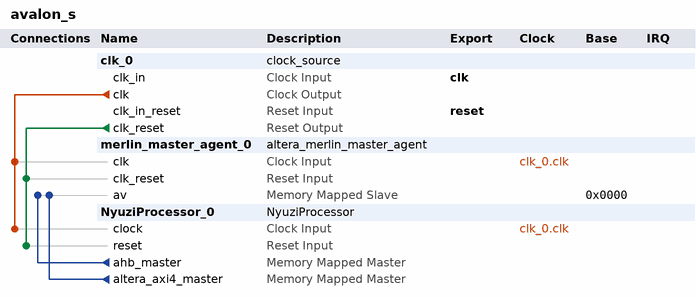
[diagram p0: system contents]
# Platform Designer (Qsys) system avalon_s, Cyclone V 5CSXFC6D6F31C8ES
# Parameters at their usual value, and those the tool derives, are not listed.
package require -exact qsys 13.0
create_system avalon_s
set_project_property DEVICE_FAMILY {Cyclone V}
set_project_property DEVICE 5CSXFC6D6F31C8ES

add_instance clk_0 clock_source 13.0
set_instance_parameter_value clk_0 clockFrequency 50000000

add_instance merlin_master_agent_0 altera_merlin_master_agent 13.0
set_instance_parameter_value merlin_master_agent_0 PKT_PROTECTION_H 80
set_instance_parameter_value merlin_master_agent_0 PKT_PROTECTION_L 80
set_instance_parameter_value merlin_master_agent_0 PKT_BEGIN_BURST 81
set_instance_parameter_value merlin_master_agent_0 PKT_BURSTWRAP_H 79
set_instance_parameter_value merlin_master_agent_0 PKT_BURSTWRAP_L 77
set_instance_parameter_value merlin_master_agent_0 PKT_BURST_SIZE_H 86
set_instance_parameter_value merlin_master_agent_0 PKT_BURST_SIZE_L 84
set_instance_parameter_value merlin_master_agent_0 PKT_BURST_TYPE_H 94
set_instance_parameter_value merlin_master_agent_0 PKT_BURST_TYPE_L 93
set_instance_parameter_value merlin_master_agent_0 PKT_BYTE_CNT_H 76
set_instance_parameter_value merlin_master_agent_0 PKT_BYTE_CNT_L 74
set_instance_parameter_value merlin_master_agent_0 PKT_ADDR_H 73
set_instance_parameter_value merlin_master_agent_0 PKT_ADDR_L 42
set_instance_parameter_value merlin_master_agent_0 PKT_TRANS_COMPRESSED_READ 41
set_instance_parameter_value merlin_master_agent_0 PKT_TRANS_POSTED 40
set_instance_parameter_value merlin_master_agent_0 PKT_TRANS_WRITE 39
set_instance_parameter_value merlin_master_agent_0 PKT_TRANS_READ 38
set_instance_parameter_value merlin_master_agent_0 PKT_TRANS_LOCK 82
set_instance_parameter_value merlin_master_agent_0 PKT_TRANS_EXCLUSIVE 83
set_instance_parameter_value merlin_master_agent_0 PKT_DATA_H 37
set_instance_parameter_value merlin_master_agent_0 PKT_DATA_L 6
set_instance_parameter_value merlin_master_agent_0 PKT_BYTEEN_H 5
set_instance_parameter_value merlin_master_agent_0 PKT_BYTEEN_L 2
set_instance_parameter_value merlin_master_agent_0 PKT_SRC_ID_H 1
set_instance_parameter_value merlin_master_agent_0 PKT_SRC_ID_L 1
set_instance_parameter_value merlin_master_agent_0 PKT_DEST_ID_H 0
set_instance_parameter_value merlin_master_agent_0 PKT_DEST_ID_L 0
set_instance_parameter_value merlin_master_agent_0 PKT_THREAD_ID_H 88
set_instance_parameter_value merlin_master_agent_0 PKT_THREAD_ID_L 87
set_instance_parameter_value merlin_master_agent_0 PKT_CACHE_H 92
set_instance_parameter_value merlin_master_agent_0 PKT_CACHE_L 89
set_instance_parameter_value merlin_master_agent_0 PKT_DATA_SIDEBAND_H 105
set_instance_parameter_value merlin_master_agent_0 PKT_DATA_SIDEBAND_L 98
set_instance_parameter_value merlin_master_agent_0 PKT_QOS_H 109
set_instance_parameter_value merlin_master_agent_0 PKT_QOS_L 106
set_instance_parameter_value merlin_master_agent_0 PKT_ADDR_SIDEBAND_H 97
set_instance_parameter_value merlin_master_agent_0 PKT_ADDR_SIDEBAND_L 93
set_instance_parameter_value merlin_master_agent_0 PKT_RESPONSE_STATUS_H 111
set_instance_parameter_value merlin_master_agent_0 PKT_RESPONSE_STATUS_L 110
set_instance_parameter_value merlin_master_agent_0 ST_DATA_W 112
set_instance_parameter_value merlin_master_agent_0 ST_CHANNEL_W 1
set_instance_parameter_value merlin_master_agent_0 AV_BURSTCOUNT_W 3
set_instance_parameter_value merlin_master_agent_0 AV_LINEWRAPBURSTS 0
set_instance_parameter_value merlin_master_agent_0 AV_BURSTBOUNDARIES 0
set_instance_parameter_value merlin_master_agent_0 SUPPRESS_0_BYTEEN_RSP 1
set_instance_parameter_value merlin_master_agent_0 ID 1
set_instance_parameter_value merlin_master_agent_0 BURSTWRAP_VALUE 4
set_instance_parameter_value merlin_master_agent_0 CACHE_VALUE 0
set_instance_parameter_value merlin_master_agent_0 SECURE_ACCESS_BIT 1
set_instance_parameter_value merlin_master_agent_0 USE_READRESPONSE 0
set_instance_parameter_value merlin_master_agent_0 USE_WRITERESPONSE 0

add_instance NyuziProcessor_0 NyuziProcessor 1.0
set_instance_parameter_value NyuziProcessor_0 RESET_PC 0

# connections
add_connection clk_0.clk merlin_master_agent_0.clk clock
add_connection clk_0.clk NyuziProcessor_0.clock clock
add_connection clk_0.clk_reset merlin_master_agent_0.clk_reset reset
add_connection clk_0.clk_reset NyuziProcessor_0.reset reset
add_connection NyuziProcessor_0.ahb_master merlin_master_agent_0.av avalon
set_connection_parameter_value NyuziProcessor_0.ahb_master/merlin_master_agent_0.av baseAddress 0x0000
add_connection NyuziProcessor_0.altera_axi4_master merlin_master_agent_0.av avalon
set_connection_parameter_value NyuziProcessor_0.altera_axi4_master/merlin_master_agent_0.av baseAddress 0x0000

# exported interfaces
add_interface clk clock sink
set_interface_property clk EXPORT_OF clk_0.clk_in
add_interface reset reset sink
set_interface_property reset EXPORT_OF clk_0.clk_in_reset

set_interconnect_requirement {$system} qsys_mm.clockCrossingAdapter HANDSHAKE
set_interconnect_requirement {$system} qsys_mm.maxAdditionalLatency 1

save_system avalon_s.qsys
